# Altium schematic sheet protoboard.SchDoc
size A
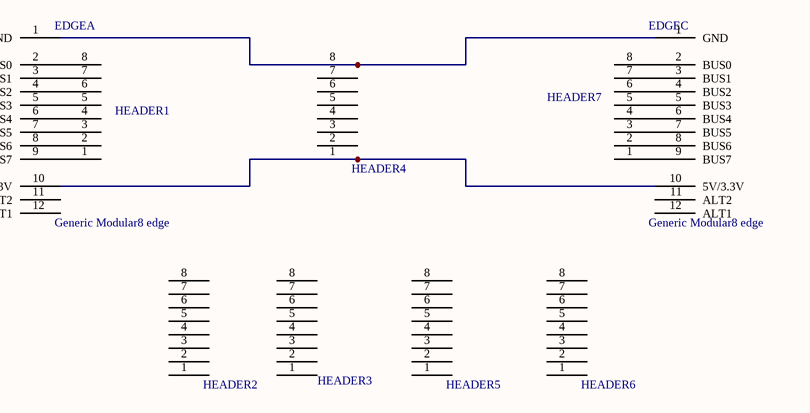
[diagram p0: protoboard.SchDoc]

## Parts
EDGEA  Generic Modular8 edge  [MODULAR8 VERTICAL PINS]
EDGEC  Generic Modular8 edge  [MODULAR8 VERTICAL PINS]
HEADER1  8x1  [8x1 THRU HOLES 0.1" PITCH]  (value not drawn)
HEADER2  8x1  [8x1 THRU HOLES 0.1" PITCH]  (value not drawn)
HEADER3  8x1  [8x1 THRU HOLES 0.1" PITCH]  (value not drawn)
HEADER4  8x1  [8x1 THRU HOLES 0.1" PITCH]  (value not drawn)
HEADER5  8x1  [8x1 THRU HOLES 0.1" PITCH]  (value not drawn)
HEADER6  8x1  [8x1 THRU HOLES 0.1" PITCH]  (value not drawn)
HEADER7  8x1  [8x1 THRU HOLES 0.1" PITCH]  (value not drawn)

## Nets
NetEDGEA_1: EDGEA.1(GND) EDGEC.1(GND) HEADER4.8
NetEDGEA_2: EDGEA.2(BUS0) HEADER1.8
NetEDGEA_3: EDGEA.3(BUS1) HEADER1.7
NetEDGEA_4: EDGEA.4(BUS2) HEADER1.6
NetEDGEA_5: EDGEA.5(BUS3) HEADER1.5
NetEDGEA_6: EDGEA.6(BUS4) HEADER1.4
NetEDGEA_7: EDGEA.7(BUS5) HEADER1.3
NetEDGEA_8: EDGEA.8(BUS6) HEADER1.2
NetEDGEA_9: EDGEA.9(BUS7) HEADER1.1
NetEDGEA_10: EDGEA.10(5V/3.3V) EDGEC.10(5V/3.3V) HEADER4.1
NetEDGEC_2: EDGEC.2(BUS0) HEADER7.8
NetEDGEC_3: EDGEC.3(BUS1) HEADER7.7
NetEDGEC_4: EDGEC.4(BUS2) HEADER7.6
NetEDGEC_5: EDGEC.5(BUS3) HEADER7.5
NetEDGEC_6: EDGEC.6(BUS4) HEADER7.4
NetEDGEC_7: EDGEC.7(BUS5) HEADER7.3
NetEDGEC_8: EDGEC.8(BUS6) HEADER7.2
NetEDGEC_9: EDGEC.9(BUS7) HEADER7.1

Not connected (* = marked no-connect by the designer): EDGEA 11(ALT2) 12(ALT1); EDGEC 11(ALT2) 12(ALT1); HEADER2 1 2 3 4 5 6 7 8; HEADER3 1 2 3 4 5 6 7 8; HEADER4 2 3 4 5 6 7; HEADER5 1 2 3 4 5 6 7 8; HEADER6 1 2 3 4 5 6 7 8